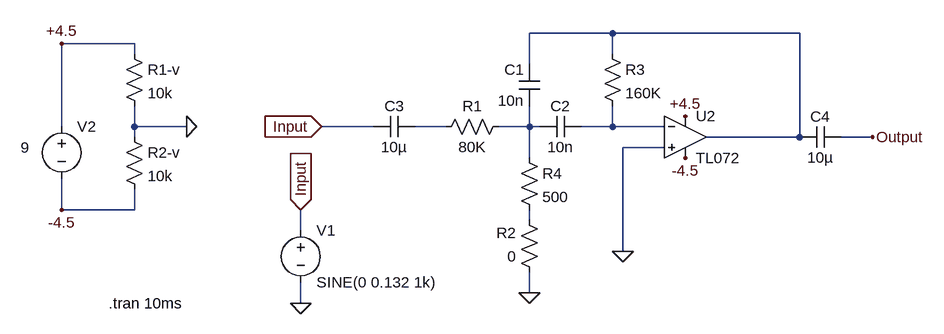
[diagram p0: schematic Wah.asc]
Wah.asc, the LTspice schematic file:
Version 4
SHEET 1 880 856
WIRE -448 352 -576 352
WIRE -160 352 -448 352
WIRE -1184 368 -1296 368
WIRE -1184 384 -1184 368
WIRE -448 384 -448 352
WIRE -576 400 -576 352
WIRE -1296 496 -1296 368
WIRE -1184 496 -1184 464
WIRE -1104 496 -1184 496
WIRE -816 496 -896 496
WIRE -704 496 -752 496
WIRE -576 496 -576 464
WIRE -576 496 -624 496
WIRE -560 496 -576 496
WIRE -448 496 -448 464
WIRE -448 496 -496 496
WIRE -368 496 -448 496
WIRE -1184 512 -1184 496
WIRE -160 512 -160 352
WIRE -160 512 -304 512
WIRE -48 512 -96 512
WIRE -368 528 -432 528
WIRE -576 544 -576 496
WIRE -1296 624 -1296 576
WIRE -1184 624 -1184 592
WIRE -1184 624 -1296 624
WIRE -576 640 -576 624
WIRE -928 656 -928 624
WIRE -432 688 -432 528
WIRE -576 752 -576 720
WIRE -928 768 -928 736
FLAG -48 512 Output
FLAG -1104 496 0
FLAG -576 752 0
FLAG -432 688 0
FLAG -1296 368 +4.5
FLAG -1296 624 -4.5
FLAG -896 496 Input
IOPIN -896 496 In
FLAG -336 480 +4.5
FLAG -336 544 -4.5
FLAG -928 768 0
FLAG -928 624 Input
IOPIN -928 624 In
SYMBOL voltage -1296 480 R0
WINDOW 123 24 44 Left 2
WINDOW 39 0 0 Left 0
WINDOW 3 -63 48 Left 2
SYMATTR Value 9
SYMATTR InstName V2
SYMBOL res -560 736 R180
WINDOW 0 36 76 Left 2
WINDOW 3 36 40 Left 2
SYMATTR InstName R2
SYMATTR Value 0
SYMBOL res -1200 368 R0
SYMATTR InstName R1-v
SYMATTR Value 10k
SYMBOL res -1200 496 R0
SYMATTR InstName R2-v
SYMATTR Value 10k
SYMBOL res -608 480 R90
WINDOW 0 0 56 VBottom 2
WINDOW 3 32 56 VTop 2
SYMATTR InstName R1
SYMATTR Value 80K
SYMBOL cap -560 464 R180
WINDOW 0 24 56 Left 2
WINDOW 3 24 8 Left 2
SYMATTR InstName C1
SYMATTR Value 10n
SYMBOL cap -560 512 R270
WINDOW 0 32 32 VTop 2
WINDOW 3 0 32 VBottom 2
SYMATTR InstName C2
SYMATTR Value 10n
SYMBOL res -464 368 R0
SYMATTR InstName R3
SYMATTR Value 160K
SYMBOL cap -752 480 R90
WINDOW 0 0 32 VBottom 2
WINDOW 3 32 32 VTop 2
SYMATTR InstName C3
SYMATTR Value 10µ
SYMBOL cap -96 496 R90
WINDOW 0 0 32 VBottom 2
WINDOW 3 32 32 VTop 2
SYMATTR InstName C4
SYMATTR Value 10µ
SYMBOL res -592 528 R0
SYMATTR InstName R4
SYMATTR Value 500
SYMBOL TL072 -336 512 R0
SYMATTR InstName U2
SYMBOL voltage -928 640 R0
WINDOW 123 0 0 Left 0
WINDOW 39 0 0 Left 0
SYMATTR InstName V1
SYMATTR Value SINE(0 0.132 1k)
TEXT -1224 768 Left 2 !.tran 10ms

The netlist it stands for:
* Wah.asc
V2 +4.5 -4.5 9
R2 0 N005 0
R1-v +4.5 0 10k
R2-v 0 -4.5 10k
R1 N003 N002 80K
C1 N003 N001 10n
C2 N003 N004 10n
R3 N001 N004 160K
C3 N002 Input 10µ
C4 Output N001 10µ
R4 N003 N005 500
* U2: TL072 (symbol TL072 not available, pins judged from their places): In+=0 In-=N004 V+=+4.5 V-=-4.5 OUT=N001
V1 Input 0 SINE(0 0.132 1k)
.tran 10ms
.backanno
.end